# Altium project pico_pcb.PrjPcb
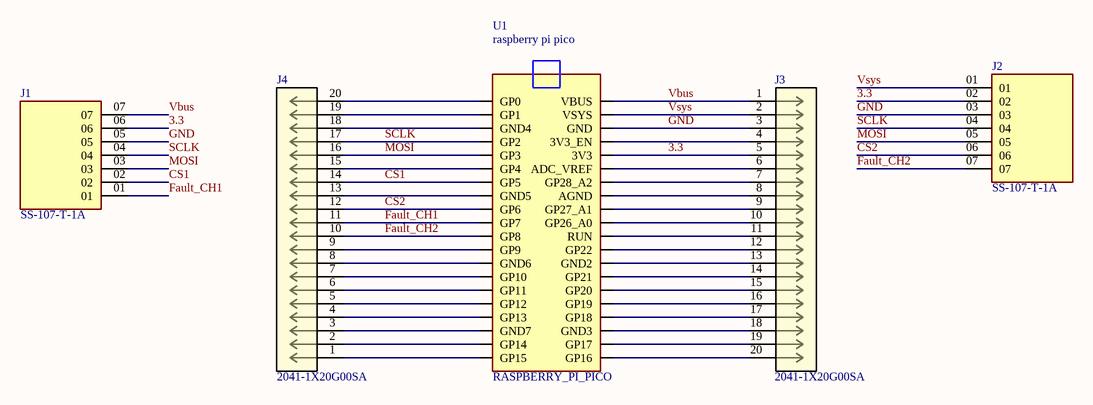
[diagram p0: pico_v1.SchDoc]
1 sheet, 5 parts. Net scope: global (net labels, ports and power ports of the same name join across sheets).
Board file: pico_v1.PcbDoc

## Sheet pico_v1.SchDoc
size A4; SheetNumber: 1; SheetTotal: 1

### Parts
J1  SS-107-T-1A  [SAMTEC_SS-107-T-1A]
J2  SS-107-T-1A  [SAMTEC_SS-107-T-1A]
J3  2041-1X20G00SA  [CONN_2041-1X20xxxSx_OUP]
J4  2041-1X20G00SA  [CONN_2041-1X20xxxSx_OUP]
U1  RASPBERRY_PI_PICO  [RASPBERRY_PI_PICO]

### Nets
3.3: J1.06 J2.02 J3.5 U1.3V3
CS1: J1.02 J4.14 U1.GP5
CS2: J2.06 J4.12 U1.GP6
Fault_CH1: J1.01 J4.11 U1.GP7
Fault_CH2: J2.07 J4.10 U1.GP8
GND: J1.05 J2.03 J3.3 U1.GND
MOSI: J1.03 J2.05 J4.16 U1.GP3
SCLK: J1.04 J2.04 J4.17 U1.GP2
Vbus: J1.07 J3.1 U1.VBUS
Vsys: J2.01 J3.2 U1.VSYS
NetJ3_4: J3.4 U1.3V3_EN
NetJ3_6: J3.6 U1.ADC_VREF
NetJ3_7: J3.7 U1.GP28_A2
NetJ3_8: J3.8 U1.AGND
NetJ3_9: J3.9 U1.GP27_A1
NetJ3_10: J3.10 U1.GP26_A0
NetJ3_11: J3.11 U1.RUN
NetJ3_12: J3.12 U1.GP22
NetJ3_13: J3.13 U1.GND2
NetJ3_14: J3.14 U1.GP21
NetJ3_15: J3.15 U1.GP20
NetJ3_16: J3.16 U1.GP19
NetJ3_17: J3.17 U1.GP18
NetJ3_18: J3.18 U1.GND3
NetJ3_19: J3.19 U1.GP17
NetJ3_20: J3.20 U1.GP16
NetJ4_1: J4.1 U1.GP15
NetJ4_2: J4.2 U1.GP14
NetJ4_3: J4.3 U1.GND7
NetJ4_4: J4.4 U1.GP13
NetJ4_5: J4.5 U1.GP12
NetJ4_6: J4.6 U1.GP11
NetJ4_7: J4.7 U1.GP10
NetJ4_8: J4.8 U1.GND6
NetJ4_9: J4.9 U1.GP9
NetJ4_13: J4.13 U1.GND5
NetJ4_15: J4.15 U1.GP4
NetJ4_18: J4.18 U1.GND4
NetJ4_19: J4.19 U1.GP1
NetJ4_20: J4.20 U1.GP0

### Notes on the sheet
- (in symbol RASPBERRY_PI_PICO) raspberry pi pico

### Library data of the parts
J3 J4 = 2041-1X20G00SA: Description; Manufacturer_Name: Oupiin; Copyright: Copyright (C) 2025 Ultra Librarian. All rights reserved.; Manufacturer_Part_Number: 2041-1X20G00SA; RefDes: RefDes; Type: Type
U1 = RASPBERRY_PI_PICO: Raspberry Pi Board, Arm Cortex-M0+; Core Architecture:Arm; Core Sub-Architecture:Cortex-M0+; Kit Contents:Raspberry Pi Pico Board; No. Of Bits:32Bit; Silicon Core Number:Rp2040; Silicon Manufacturer:Raspberry Pi |Raspberry-Pi RASPBERRY PI PICO; SnapEDA_Link: https://www.snapeda.com/parts/RASPBERRY%20PI%20PICO/Raspberry+Pi/view-part/?ref=snap; Package: None; Value: *; MF: Raspberry Pi; MP: RASPBERRY PI PICO; Check_prices: https://www.snapeda.com/parts/RASPBERRY%20PI%20PICO/Raspberry+Pi/view-part/?ref=eda
J1 J2 = SS-107-T-1A: Package: None; Price: None; Value: *; MP: SS-107-T-1A; Availability: Unavailable